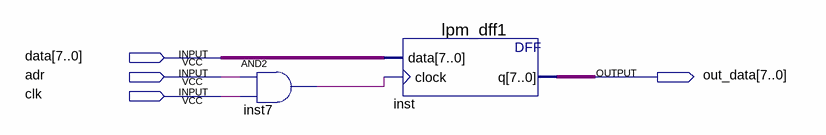
[diagram p0: schematic sheet]
// Quartus schematic slave_device.bdf as structural Verilog: 2 symbols, 4 pins
module slave_device (
  input  [7:0] data,
  input  adr,
  input  clk,
  output [7:0] out_data
);

  wire inst7_out;

  and inst7 (inst7_out, adr, clk);
  lpm_dff1 inst (.data(data), .clock(inst7_out), .q(out_data));
endmodule
